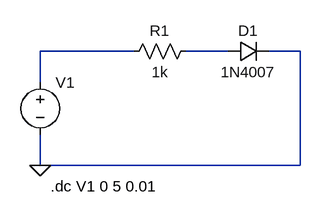
[diagram p0: schematic curva do diodo.asc]
curva do diodo.asc, the LTspice schematic file:
Version 4.1
SHEET 1 880 680
WIRE 160 80 16 80
WIRE 304 80 240 80
WIRE 416 80 368 80
WIRE 16 128 16 80
WIRE 16 256 16 208
WIRE 416 256 416 80
WIRE 416 256 16 256
FLAG 16 256 0
SYMBOL res 256 64 R90
WINDOW 0 0 56 VBottom 2
WINDOW 3 32 56 VTop 2
SYMATTR InstName R1
SYMATTR Value 1k
SYMBOL voltage 16 112 R0
WINDOW 123 0 0 Left 0
WINDOW 39 0 0 Left 0
SYMATTR InstName V1
SYMATTR Value ""
SYMBOL diode 304 96 R270
WINDOW 0 32 32 VTop 2
WINDOW 3 0 32 VBottom 2
SYMATTR InstName D1
SYMATTR Value 1N4007
TEXT 32 288 Left 2 !.dc V1 0 5 0.01

The netlist it stands for:
* curva do diodo.asc
R1 N002 N001 1k
V1 N001 0
D1 N002 0 1N4007
.model D D
.lib standard.dio
.dc V1 0 5 0.01
.backanno
.end